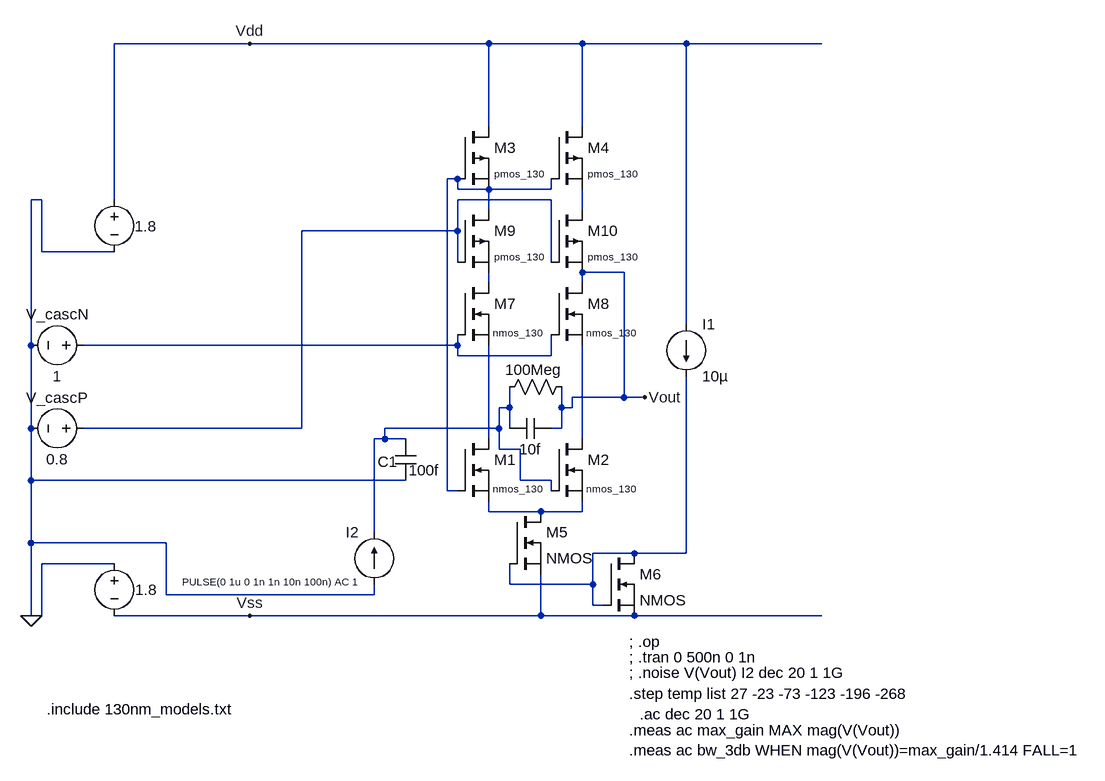
[diagram p0: schematic csa-frontend CM.asc]
csa-frontend CM.asc, the LTspice schematic file:
Version 4
SHEET 1 1460 972
WIRE 128 -208 -80 -208
WIRE 496 -208 128 -208
WIRE 640 -208 496 -208
WIRE 800 -208 640 -208
WIRE 1008 -208 800 -208
WIRE 496 -80 496 -208
WIRE 640 -80 640 -208
WIRE 448 0 432 0
WIRE 448 16 448 0
WIRE 496 16 448 16
WIRE 592 16 592 0
WIRE 592 16 496 16
WIRE -192 32 -208 32
WIRE -80 32 -80 -208
WIRE 592 32 448 32
WIRE 496 48 496 16
WIRE 640 48 640 16
WIRE 448 80 448 32
WIRE 448 80 208 80
WIRE -192 112 -192 32
WIRE -80 112 -192 112
WIRE 448 128 448 80
WIRE 592 128 592 32
WIRE 704 144 640 144
WIRE 496 160 496 144
WIRE 640 160 640 144
WIRE 800 224 800 -208
WIRE -208 256 -208 32
WIRE 448 256 448 240
WIRE 448 256 -128 256
WIRE 448 272 448 256
WIRE 592 272 592 240
WIRE 592 272 448 272
WIRE 704 336 704 144
WIRE 704 336 624 336
WIRE 736 336 704 336
WIRE 528 352 528 320
WIRE 528 352 512 352
WIRE 608 352 608 320
WIRE 624 352 624 336
WIRE 624 352 608 352
WIRE -208 384 -208 256
WIRE 208 384 208 80
WIRE 208 384 -128 384
WIRE 512 384 512 352
WIRE 512 384 336 384
WIRE 528 384 528 352
WIRE 608 384 608 352
WIRE 608 384 592 384
WIRE 336 400 336 384
WIRE 336 400 320 400
WIRE 368 400 336 400
WIRE 496 400 496 256
WIRE 640 400 640 256
WIRE 512 416 512 384
WIRE 544 416 512 416
WIRE -208 464 -208 384
WIRE 368 464 -208 464
WIRE 544 464 544 416
WIRE 592 464 544 464
WIRE 432 480 432 0
WIRE 448 480 432 480
WIRE 592 480 592 464
WIRE 496 512 496 496
WIRE 576 512 496 512
WIRE 640 512 640 496
WIRE 640 512 576 512
WIRE 320 544 320 400
WIRE -208 560 -208 464
WIRE 0 560 -208 560
WIRE 720 576 656 576
WIRE 800 576 800 304
WIRE 800 576 720 576
WIRE -80 592 -192 592
WIRE 528 624 528 592
WIRE 656 624 656 576
WIRE 656 624 528 624
WIRE 0 640 0 560
WIRE 320 640 320 624
WIRE 320 640 0 640
WIRE 656 656 656 624
WIRE 672 656 656 656
WIRE -208 672 -208 560
WIRE -192 672 -192 592
WIRE -192 672 -208 672
WIRE 128 672 -80 672
WIRE 576 672 576 608
WIRE 576 672 128 672
WIRE 720 672 576 672
WIRE 1008 672 720 672
FLAG -208 672 0
FLAG 128 -208 Vdd
FLAG 128 672 Vss
FLAG 736 336 Vout
SYMBOL voltage -80 16 R0
WINDOW 0 24 16 Invisible 2
WINDOW 3 31 57 Left 2
SYMATTR InstName Vdd
SYMATTR Value 1.8
SYMBOL voltage -80 576 R0
WINDOW 0 24 16 Invisible 2
WINDOW 3 32 56 Left 2
SYMATTR InstName Vss
SYMATTR Value 1.8
SYMBOL nmos 448 400 R0
WINDOW 3 54 77 Left 1
SYMATTR Value nmos_130
SYMATTR InstName M1
SYMBOL pmos 448 -80 R0
WINDOW 3 56 72 Left 1
SYMATTR Value pmos_130
SYMATTR InstName M3
SYMATTR Value2 L=0.13u W=2.6u
SYMBOL cap 352 400 R0
WINDOW 0 -27 35 Left 2
WINDOW 3 21 48 Left 2
SYMATTR InstName C1
SYMATTR Value 100f
SYMBOL current 320 624 R180
WINDOW 0 24 80 Left 2
WINDOW 3 296 4 Right 1
SYMATTR InstName I2
SYMATTR Value PULSE(0 1u 0 1n 1n 10n 100n) AC 1
SYMBOL res 624 304 R90
WINDOW 0 -22 56 Invisible 2
WINDOW 3 -26 59 VTop 2
SYMATTR InstName R1
SYMATTR Value 100Meg
SYMBOL cap 592 368 R90
WINDOW 0 0 32 Invisible 2
WINDOW 3 32 32 VTop 2
SYMATTR InstName C2
SYMATTR Value 10f
SYMBOL nmos 528 512 R0
SYMATTR InstName M5
SYMBOL nmos 672 576 R0
SYMATTR InstName M6
SYMBOL current 800 224 R0
SYMATTR InstName I1
SYMATTR Value 10µ
SYMBOL nmos 592 400 R0
WINDOW 3 54 77 Left 1
SYMATTR Value nmos_130
SYMATTR InstName M2
SYMBOL pmos 592 -80 R0
WINDOW 3 56 72 Left 1
SYMATTR Value pmos_130
SYMATTR InstName M4
SYMATTR Value2 L=0.13u W=2.6u
SYMBOL nmos 448 160 R0
WINDOW 3 54 77 Left 1
SYMATTR Value nmos_130
SYMATTR InstName M7
SYMBOL nmos 592 160 R0
WINDOW 3 54 77 Left 1
SYMATTR Value nmos_130
SYMATTR InstName M8
SYMBOL pmos 448 48 R0
WINDOW 3 56 72 Left 1
SYMATTR Value pmos_130
SYMATTR InstName M9
SYMATTR Value2 L=0.13u W=2.6u
SYMBOL pmos 592 48 R0
WINDOW 3 56 72 Left 1
SYMATTR Value pmos_130
SYMATTR InstName M10
SYMATTR Value2 L=0.13u W=2.6u
SYMBOL voltage -112 384 R90
WINDOW 0 -32 56 VBottom 2
WINDOW 3 32 56 VTop 2
SYMATTR InstName V_cascP
SYMATTR Value 0.8
SYMBOL voltage -112 256 R90
WINDOW 0 -32 56 VBottom 2
WINDOW 3 32 56 VTop 2
SYMATTR InstName V_cascN
SYMATTR Value 1
TEXT -184 816 Left 2 !.include 130nm_models.txt
TEXT 712 736 Left 2 !; .tran 0 500n 0 1n
TEXT 712 712 Left 2 !; .op
TEXT 712 760 Left 2 !; .noise V(Vout) I2 dec 20 1 1G
TEXT 712 792 Left 2 !.step temp list 27 -23 -73 -123 -196 -268
TEXT 728 824 Left 2 !.ac dec 20 1 1G
TEXT 712 848 Left 2 !.meas ac max_gain MAX mag(V(Vout))\n.meas ac bw_3db WHEN mag(V(Vout))=max_gain/1.414 FALL=1

The netlist it stands for:
* csa-frontend CM.asc
Vdd Vdd 0 1.8
Vss 0 Vss 1.8
M1 N007 N001 N009 N009 nmos_130
M3 Vdd N001 N001 N001 pmos_130 L=0.13u W=2.6u
C1 N006 0 100f
I2 0 N006 PULSE(0 1u 0 1n 1n 10n 100n) AC 1
R1 Vout N006 100Meg
C2 Vout N006 10f
M5 N009 N010 Vss Vss NMOS
M6 N010 N010 Vss Vss NMOS
I1 Vdd N010 10µ
M2 N008 N006 N009 N009 nmos_130
M4 Vdd N001 N003 N003 pmos_130 L=0.13u W=2.6u
M7 N004 N005 N007 N007 nmos_130
M8 Vout N005 N008 N008 nmos_130
M9 N001 N002 N004 N004 pmos_130 L=0.13u W=2.6u
M10 N003 N002 Vout Vout pmos_130 L=0.13u W=2.6u
V_cascP N002 0 0.8
V_cascN N005 0 1
.model NMOS NMOS
.model PMOS PMOS
.lib standard.mos
.include 130nm_models.txt
; .tran 0 500n 0 1n
; .op
; .noise V(Vout) I2 dec 20 1 1G
.step temp list 27 -23 -73 -123 -196 -268
.ac dec 20 1 1G
.meas ac max_gain MAX mag(V(Vout))
.meas ac bw_3db WHEN mag(V(Vout))=max_gain/1.414 FALL=1
.backanno
.end